# Altium project PX4FMUv2.4.6.PrjPcb (part 2 of 2)

## Sheet PX4FMUv2.4.6_9.SchDoc
size 282 x 200 mm
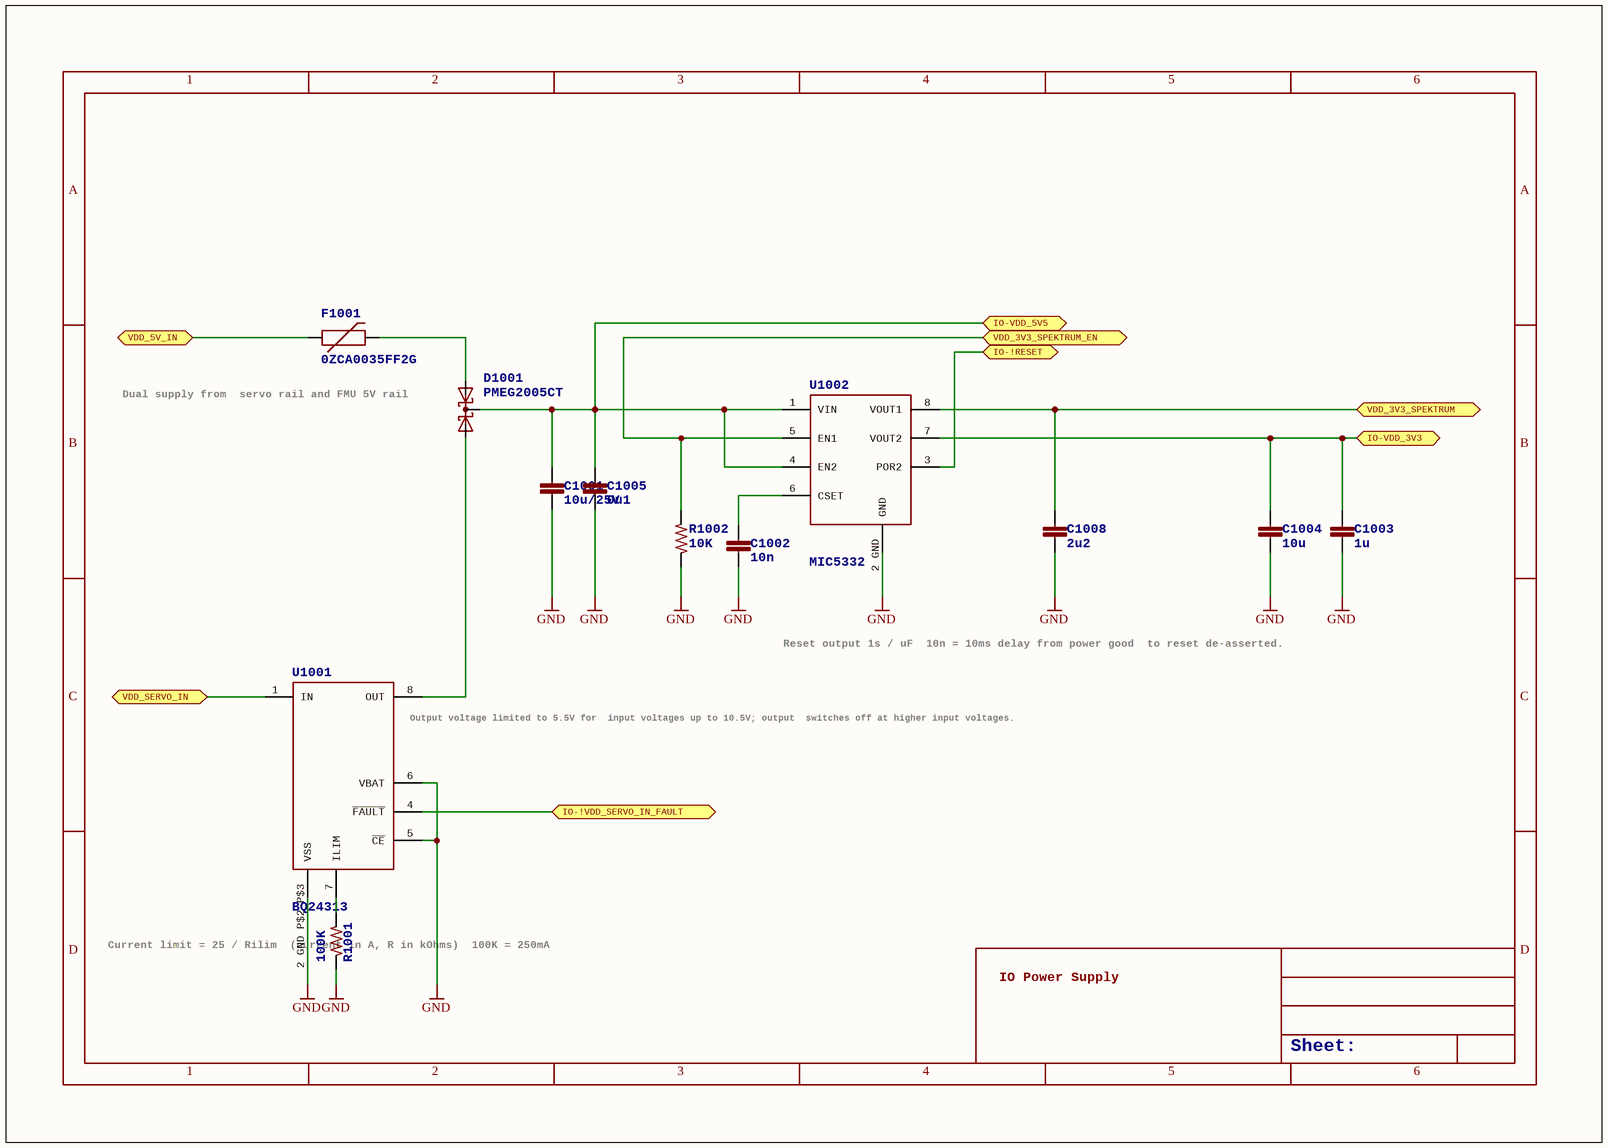
[diagram p9: PX4FMUv2.4.6_9.SchDoc]

### Parts
C1001  10u/25V  [0805-CAP]
C1002  10n  [0402-CAP]
C1003  1u  [0603-CAP]
C1004  10u  [0603-CAP]
C1005  0u1  [0402-CAP]
C1008  2u2  [0402-CAP]
D1001  PMEG2005CT  [SOT23-3]
F1001  0ZCA0035FF2G  [PTC-1206]
R1001  100K  [0402-RES]
R1002  10K  [0402-RES]
U1001  BQ24313  [QFN8-DSG]
U1002  MIC5332  [MLF-8-EPAD]

### Ports
IO-!RESET, IO-!VDD_SERVO_IN_FAULT, IO-VDD_3V3, IO-VDD_5V5, VDD_3V3_SPEKTRUM, VDD_3V3_SPEKTRUM_EN, VDD_5V_IN, VDD_SERVO_IN

### Nets
GND: C1001.P$2 C1002.P$2 C1003.P$2 C1004.P$2 C1005.P$2 C1008.P$2 R1001.P$1 R1002.P$1 U1001.2_GND_P$2_P$3(VSS) U1001.5(~{CE}) U1001.6(VBAT) U1002.2_GND(GND)
NetC702_P$1: F1001.1 ; port VDD_5V_IN
NetC801_P$2: U1002.3(POR2) ; port IO-!RESET
NetC802_P$1: C1003.P$1 C1004.P$1 U1002.7(VOUT2) ; port IO-VDD_3V3
NetC1001_P$1: C1001.P$1 C1005.P$1 D1001.3(CC) U1002.1(VIN) U1002.4(EN2) ; port IO-VDD_5V5
NetC1002_P$1: C1002.P$1 U1002.6(CSET)
NetC1008_P$1: C1008.P$1 U1002.8(VOUT1) ; port VDD_3V3_SPEKTRUM
NetD1001_1: D1001.1(A1) F1001.2
NetD1001_2: D1001.2(A2) U1001.8(OUT)
NetL901_P$2: U1001.1(IN) ; port VDD_SERVO_IN
NetR1001_P$2: R1001.P$2 U1001.7(ILIM)
NetR1002_P$2: R1002.P$2 U1002.5(EN1) ; port VDD_3V3_SPEKTRUM_EN
NetU801_38: U1001.4(~{FAULT}) ; port IO-!VDD_SERVO_IN_FAULT

### Notes on the sheet
- (near F1001) Dual supply from
  servo rail and FMU 5V rail
- Reset output 1s / uF
  10n = 10ms delay from power good
  to reset de-asserted.
- (near U1001) Output voltage limited to 5.5V for
  input voltages up to 10.5V; output
  switches off at higher input voltages.
- (near R1001) Current limit = 25 / Rilim
  (current in A, R in kOhms)
  100K = 250mA
- IO Power Supply
- Sheet:
- 1
- 2
- 3
- 4
- 5
- 6
- A
- B
- C
- D

### Library data of the parts
C1001 = CAP0805: CapacitorStandard 0603 ceramic capacitor, and 0.1" leaded capacitor.; PARTNO: CL21A106KAYNNNE
C1002 = CAP0402: CapacitorStandard 0603 ceramic capacitor, and 0.1" leaded capacitor.; PARTNO: CC0402KRX7R7BB103
C1003 = CAP0603: CapacitorStandard 0603 ceramic capacitor, and 0.1" leaded capacitor.; PARTNO: CC0603ZRY5V7BB105
C1004 = CAP0603: CapacitorStandard 0603 ceramic capacitor, and 0.1" leaded capacitor.; PARTNO: C1608X5R1A106K080AC
C1005 = CAP0402: CapacitorStandard 0603 ceramic capacitor, and 0.1" leaded capacitor.; PARTNO: CC0402ZRY5V7BB104
C1008 = CAP0402: CapacitorStandard 0603 ceramic capacitor, and 0.1" leaded capacitor.; PARTNO: C1005X6S1C225K050BC
D1001 = PMEG2005CT: 500 mA low VF dual MEGA Schottky barrier rectifier   http://www.nxp.com/documents/data_sheet/PMEG2005CT.pdf; PARTNO: PMEG2005CT
F1001 = PTCSMD: Resettable Fuse PTCResettable Fuse. Spark Fun Electronics SKU : COM-08357; PARTNO: 0ZCA0035FF2G
R1001 = RESISTOR0402-RES: as R713 on sheet PX4FMUv2.4.6_6
R1002 = RESISTOR0402-RES: ResistorBasic schematic elements and footprints for 0603, 1206, and PTH 1/10th watt (small) resistors.; PARTNO: RC0402FR-0710KL
U1001 = BQ24313: PARTNO: BQ24313DSGT
U1002 = MIC5332: PARTNO: MIC5332-SSYMT

## Sheet PX4FMUv2.4.6_10.SchDoc
size 282 x 200 mm
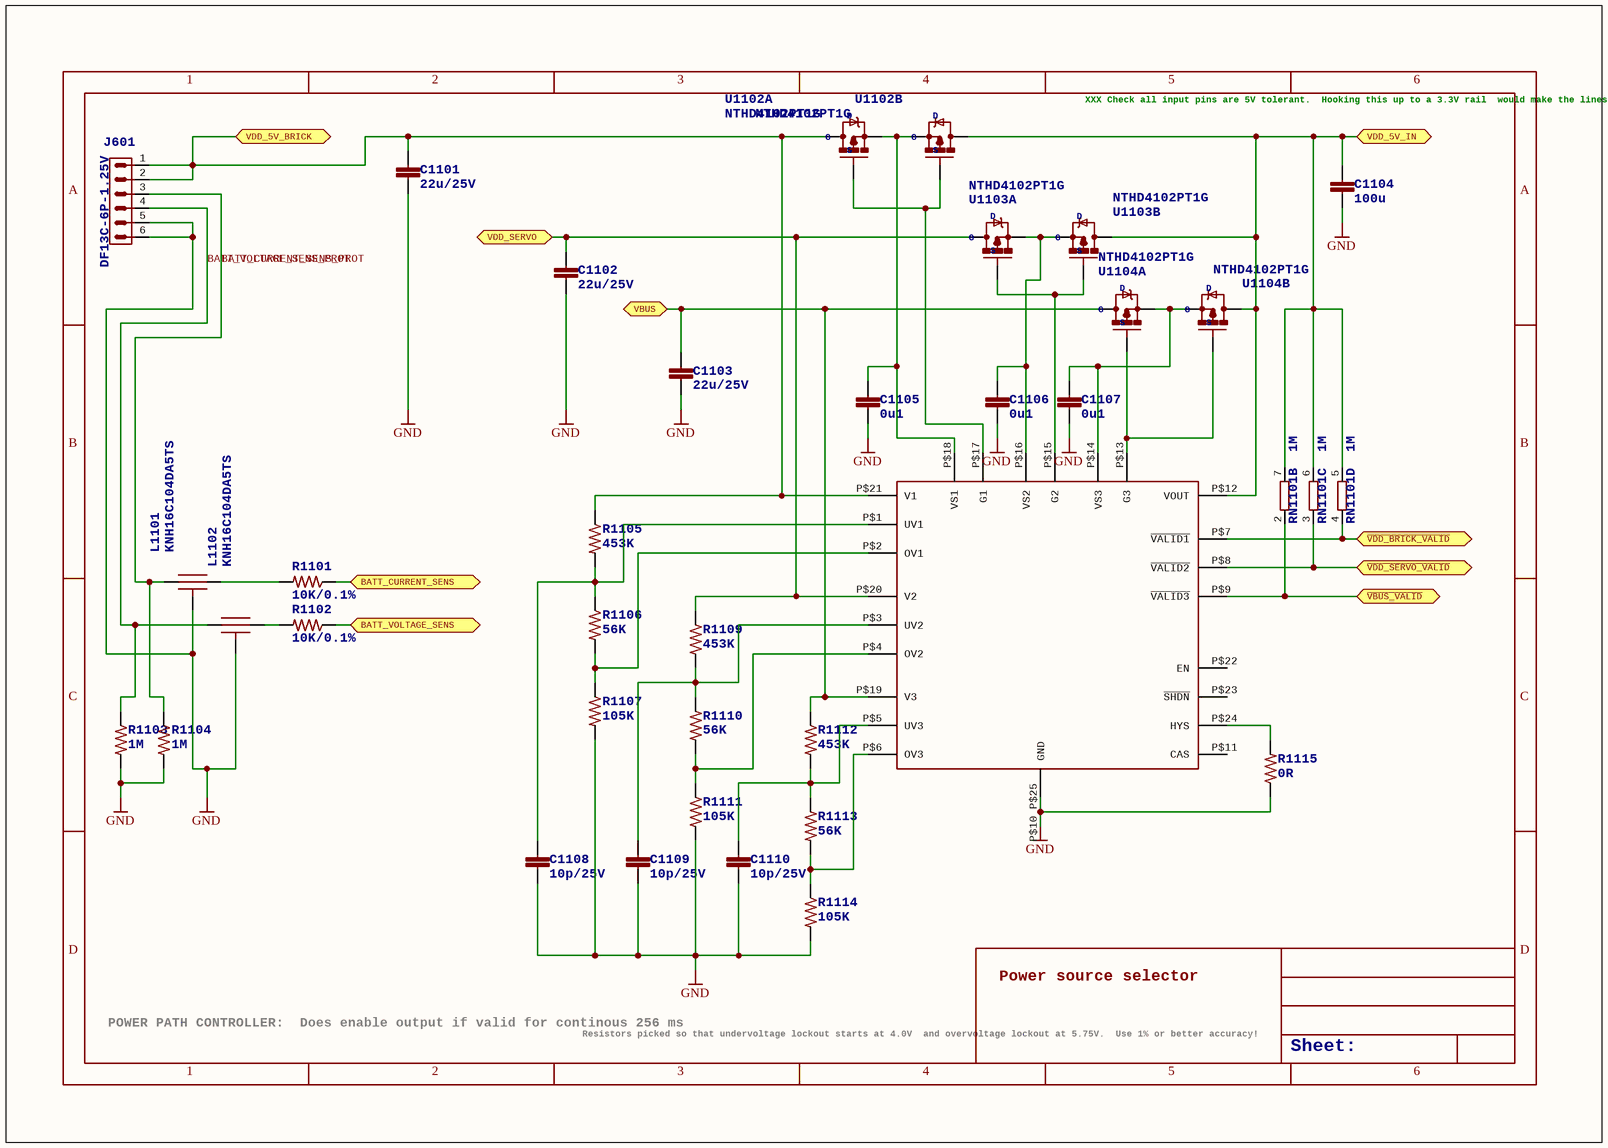
[diagram p10: PX4FMUv2.4.6_10.SchDoc]

### Parts
C1101  22u/25V  [0805-CAP]
C1102  22u/25V  [0805-CAP]
C1103  22u/25V  [0805-CAP]
C1104  100u  [1206-CAP]
C1105  0u1  [0402-CAP]
C1106  0u1  [0402-CAP]
C1107  0u1  [0402-CAP]
C1108  10p/25V  [0402-CAP]
C1109  10p/25V  [0402-CAP]
C1110  10p/25V  [0402-CAP]
J601  DF13C-6P-1.25V  [DF13C-6P-1.25V]
L1101  KNH16C104DA5TS  [KYOCERA-KNH16-DA]
L1102  KNH16C104DA5TS  [KYOCERA-KNH16-DA]
R1101  10K/0.1%  [0402-RES]
R1102  10K/0.1%  [0402-RES]
R1103  1M  [0402-RES]
R1104  1M  [0402-RES]
R1105  453K  [0402-RES]
R1106  56K  [0402-RES]
R1107  105K  [0402-RES]
R1109  453K  [0402-RES]
R1110  56K  [0402-RES]
R1111  105K  [0402-RES]
R1112  453K  [0402-RES]
R1113  56K  [0402-RES]
R1114  105K  [0402-RES]
R1115  0R  [0402-RES]
RN1101  1M  [EXB28V]  (parts B,C,D of 4)
U1101  LTC4417  [MO-220]  (value not drawn)
U1102  NTHD4102PT1G  [1206-8]  (parts A,B of 2)
U1103  NTHD4102PT1G  [1206-8]  (parts A,B of 2)
U1104  NTHD4102PT1G  [1206-8]  (parts A,B of 2)

### Ports
BATT_CURRENT_SENS, BATT_VOLTAGE_SENS, VBUS, VDD_5V_BRICK, VDD_5V_IN, VDD_SERVO, ~{VBUS_VALID}, ~{VDD_BRICK_VALID}, ~{VDD_SERVO_VALID}

### Nets
GND: C1101.P$2 C1102.P$2 C1103.P$2 C1104.P$2 C1105.P$2 C1106.P$2 C1107.P$2 C1108.P$2 C1109.P$2 C1110.P$2 J601.5 J601.6 L1101.P$3_P$4_P$5(P$3) L1102.P$3_P$4_P$5(P$3) R1103.P$2 R1104.P$2 R1107.P$2 R1111.P$2 R1114.P$2 R1115.P$1 U1101.P$10_P$25(GND)
BATT_CURRENT_SENS_PROT: J601.3 L1101.P$1 R1104.P$1
BATT_VOLTAGE_SENS_PROT: J601.4 L1102.P$1 R1103.P$1
Net!VBUS_VALID_P$1: RN1101.2 U1101.P$9(~{VALID3}) ; port ~{VBUS_VALID}
Net!VDD_BRICK_VALID_P$1: RN1101.4 U1101.P$7(~{VALID1}) ; port ~{VDD_BRICK_VALID}
Net!VDD_SERVO_VALID_P$1: RN1101.3 U1101.P$8(~{VALID2}) ; port ~{VDD_SERVO_VALID}
NetC702_P$1: C1104.P$1 RN1101.5 RN1101.6 RN1101.7 U1101.P$12(VOUT) U1102.P$5_P$6(D) U1103.P$5_P$6(D) U1104.P$5_P$6(D) ; port VDD_5V_IN
NetC1101_P$1: C1101.P$1 J601.1 J601.2 R1105.P$1 U1101.P$21(V1) U1102.P$7_P$8(D) ; port VDD_5V_BRICK
NetC1102_P$1: C1102.P$1 R1109.P$1 U1101.P$20(V2) U1103.P$7_P$8(D) ; port VDD_SERVO
NetC1103_P$1: C1103.P$1 R1112.P$1 U1101.P$19(V3) U1104.P$7_P$8(D) ; port VBUS
NetC1105_P$1: C1105.P$1 U1101.P$18(VS1) U1102.P$1(S) U1102.P$3(S)
NetC1106_P$1: C1106.P$1 U1101.P$16(VS2) U1103.P$1(S) U1103.P$3(S)
NetC1107_P$1: C1107.P$1 U1101.P$14(VS3) U1104.P$1(S) U1104.P$3(S)
NetC1108_P$1: C1108.P$1 R1105.P$2 R1106.P$1 U1101.P$1(UV1)
NetC1109_P$1: C1109.P$1 R1109.P$2 R1110.P$1 U1101.P$3(UV2)
NetC1110_P$1: C1110.P$1 R1112.P$2 R1113.P$1 U1101.P$5(UV3)
NetL1101_P$2: L1101.P$2 R1101.P$2
NetL1102_P$2: L1102.P$2 R1102.P$2
NetR1101_P$1: R1101.P$1 ; port BATT_CURRENT_SENS
NetR1102_P$1: R1102.P$1 ; port BATT_VOLTAGE_SENS
NetR1106_P$2: R1106.P$2 R1107.P$1 U1101.P$2(OV1)
NetR1110_P$2: R1110.P$2 R1111.P$1 U1101.P$4(OV2)
NetR1113_P$2: R1113.P$2 R1114.P$1 U1101.P$6(OV3)
NetR1115_P$2: R1115.P$2 U1101.P$24(HYS)
NetU1101_P$13: U1101.P$13(G3) U1104.P$2(G) U1104.P$4(G)
NetU1101_P$15: U1101.P$15(G2) U1103.P$2(G) U1103.P$4(G)
NetU1101_P$17: U1101.P$17(G1) U1102.P$2(G) U1102.P$4(G)

Not connected (* = marked no-connect by the designer): U1101 P$11(CAS) P$22(EN) P$23(~{SHDN})

### Notes on the sheet
- XXX Check all input pins are 5V tolerant.
  Hooking this up to a 3.3V rail
  would make the lines non-readable during power-up sequencing
- POWER PATH CONTROLLER:
  Does enable output if valid for continous 256 ms
- Power source selector
- Resistors picked so that undervoltage lockout starts at 4.0V
  and overvoltage lockout at 5.75V.
  Use 1% or better accuracy!
- Sheet:
- 1
- 2
- 3
- 4
- 5
- 6
- A
- B
- C
- D

### Library data of the parts
C1101-C1103 = CAP0805: CapacitorStandard 0603 ceramic capacitor, and 0.1" leaded capacitor.; PARTNO: CL21A226MAQNNNE
C1104 = CAP1206: CapacitorStandard 0603 ceramic capacitor, and 0.1" leaded capacitor.; PARTNO: C3216X5R1A107M160AC
C1105-C1107 = CAP0402: CapacitorStandard 0603 ceramic capacitor, and 0.1" leaded capacitor.; PARTNO: C1005X7R1E104K050BB
C1108-C1110 = CAP0402: CapacitorStandard 0603 ceramic capacitor, and 0.1" leaded capacitor.; PARTNO: C0402C100J3GACTU
J601 = DF13-6P-1.25V: DF13-6P 1.25mm Pitch Miniature Crimping Connector.
L1101 L1102 = KNH16C104DA5TS: Kyocera KNH16C104DA5TS EMI filter
R1101 R1102 = RESISTOR0402-RES: ResistorBasic schematic elements and footprints for 0603, 1206, and PTH 1/10th watt (small) resistors.; PARTNO: ERA-2AEB103X
R1103 R1104 = RESISTOR0402-RES: ResistorBasic schematic elements and footprints for 0603, 1206, and PTH 1/10th watt (small) resistors.; PARTNO: RC0402FR-071ML
R1105 R1109 R1112 = RESISTOR0402-RES: ResistorBasic schematic elements and footprints for 0603, 1206, and PTH 1/10th watt (small) resistors.; PARTNO: RMCF0402FT453K
R1106 R1110 R1113 = RESISTOR0402-RES: ResistorBasic schematic elements and footprints for 0603, 1206, and PTH 1/10th watt (small) resistors.; PARTNO: ERA-2AEB563X
R1107 R1111 R1114 = RESISTOR0402-RES: ResistorBasic schematic elements and footprints for 0603, 1206, and PTH 1/10th watt (small) resistors.; PARTNO: ERJ-2RKF1053X
R1115 = RESISTOR0402-RES: ResistorBasic schematic elements and footprints for 0603, 1206, and PTH 1/10th watt (small) resistors.; PARTNO: ERJ-2GE0R00X
RN1101 = 4R-NEXB28V: Array Chip Resistor   Source: RS Component / Phycomp; PARTNO: EXB-28V105JX; OC_FARNELL: unknown; OC_NEWARK: unknown
U1101 = LTC4117: PARTNO: LTC4417IUF#PBF
U1102-U1104 = MOSFET-DUAL-PCHANNEL-CHIPFET: PARTNO: NTHD4102PT1G; D: D; S: S; G: G

## Sheet PX4FMUv2.4.6_11.SchDoc
size 282 x 200 mm
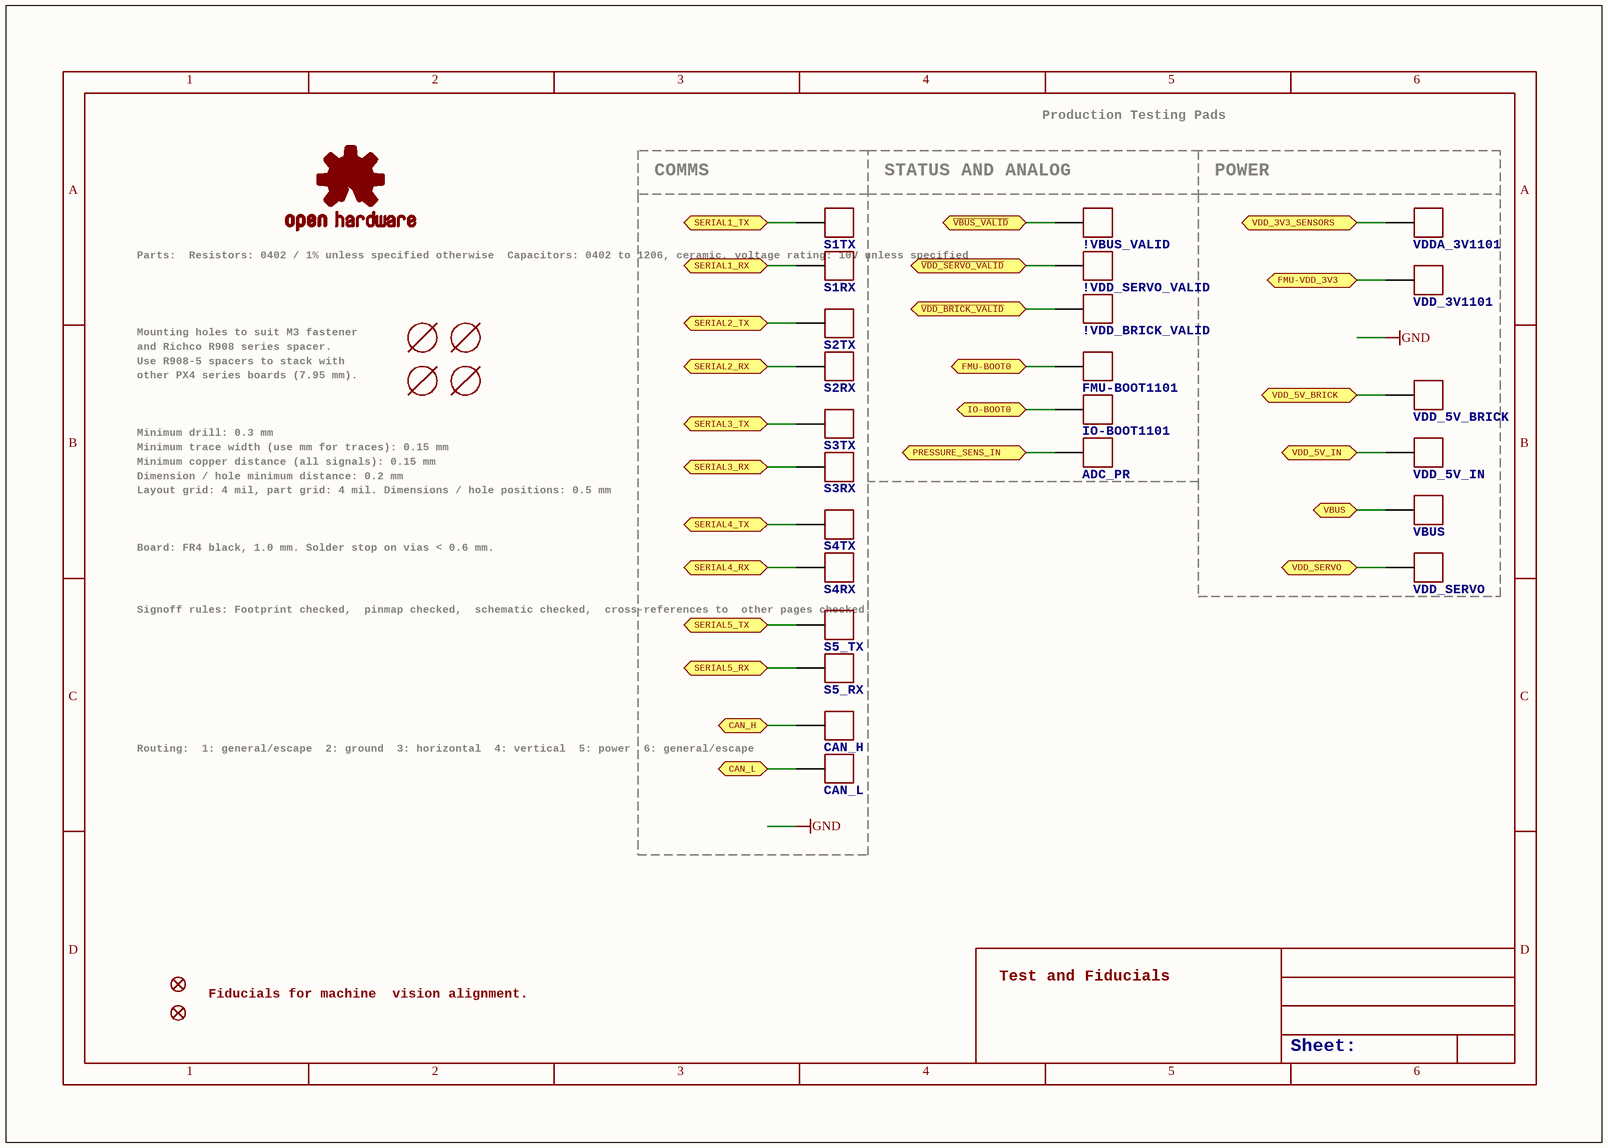
[diagram p11: PX4FMUv2.4.6_11.SchDoc]

### Parts
!VBUS_VALID  PAD.04  [PAD.04X.04]  (value not drawn)
!VDD_BRICK_VALID  PAD.04  [PAD.04X.04]  (value not drawn)
!VDD_SERVO_VALID  PAD.04  [PAD.04X.04]  (value not drawn)
ADC_PR  PAD.04  [PAD.04X.04]  (value not drawn)
CAN_H  PAD.04  [PAD.04X.04]  (value not drawn)
CAN_L  PAD.04  [PAD.04X.04]  (value not drawn)
FMU-BOOT1101  PAD.04  [PAD.04X.04]  (value not drawn)
IO-BOOT1101  PAD.04  [PAD.04X.04]  (value not drawn)
JP1  FIDUCIAL1.5X3  [FIDUCIAL-1.5X3]  (value not drawn)
JP2  FIDUCIAL1.5X3  [FIDUCIAL-1.5X3]  (value not drawn)
M3_MOUNT1101  MOUNT-HOLE3.1MM  [MOUNT-HOLE3.1]  (value not drawn)
M3_MOUNT1102  MOUNT-HOLE3.1MM  [MOUNT-HOLE3.1]  (value not drawn)
M3_MOUNT1103  MOUNT-HOLE3.1MM  [MOUNT-HOLE3.1]  (value not drawn)
M3_MOUNT1104  MOUNT-HOLE3.1MM  [MOUNT-HOLE3.1]  (value not drawn)
OSHW_LOGO  OSHW-LOGOS  [OSHW-LOGO-S]  (value not drawn)
S1RX  PAD.04  [PAD.04X.04]  (value not drawn)
S1TX  PAD.04  [PAD.04X.04]  (value not drawn)
S2RX  PAD.04  [PAD.04X.04]  (value not drawn)
S2TX  PAD.04  [PAD.04X.04]  (value not drawn)
S3RX  PAD.04  [PAD.04X.04]  (value not drawn)
S3TX  PAD.04  [PAD.04X.04]  (value not drawn)
S4RX  PAD.04  [PAD.04X.04]  (value not drawn)
S4TX  PAD.04  [PAD.04X.04]  (value not drawn)
S5_RX  PAD.04  [PAD.04X.04]  (value not drawn)
S5_TX  PAD.04  [PAD.04X.04]  (value not drawn)
VBUS  PAD.04  [PAD.04X.04]  (value not drawn)
VDD_3V1101  PAD.04  [PAD.04X.04]  (value not drawn)
VDD_5V_BRICK  PAD.04  [PAD.04X.04]  (value not drawn)
VDD_5V_IN  PAD.04  [PAD.04X.04]  (value not drawn)
VDD_SERVO  PAD.04  [PAD.04X.04]  (value not drawn)
VDDA_3V1101  PAD.04  [PAD.04X.04]  (value not drawn)

### Ports
CAN_H, CAN_L, FMU-BOOT0, FMU-VDD_3V3, IO-BOOT0, PRESSURE_SENS_IN, SERIAL1_RX, SERIAL1_TX, SERIAL2_RX, SERIAL2_TX, SERIAL3_RX, SERIAL3_TX, SERIAL4_RX, SERIAL4_TX, SERIAL5_RX, SERIAL5_TX, VBUS, VDD_3V3_SENSORS, VDD_5V_BRICK, VDD_5V_IN, VDD_SERVO, ~{VBUS_VALID}, ~{VDD_BRICK_VALID}, ~{VDD_SERVO_VALID}

### Nets
Net!VBUS_VALID_P$1: !VBUS_VALID.P$1 ; port ~{VBUS_VALID}
Net!VDD_BRICK_VALID_P$1: !VDD_BRICK_VALID.P$1 ; port ~{VDD_BRICK_VALID}
Net!VDD_SERVO_VALID_P$1: !VDD_SERVO_VALID.P$1 ; port ~{VDD_SERVO_VALID}
NetADC_PR_P$1: ADC_PR.P$1 ; port PRESSURE_SENS_IN
NetC101_P$1: VDD_3V1101.P$1 ; port FMU-VDD_3V3
NetC501_P$1: VDDA_3V1101.P$1 ; port VDD_3V3_SENSORS
NetC702_P$1: VDD_5V_IN.P$1 ; port VDD_5V_IN
NetC1101_P$1: VDD_5V_BRICK.P$1 ; port VDD_5V_BRICK
NetC1102_P$1: VDD_SERVO.P$1 ; port VDD_SERVO
NetC1103_P$1: VBUS.P$1 ; port VBUS
NetCAN_H_P$1: CAN_H.P$1 ; port CAN_H
NetCAN_L_P$1: CAN_L.P$1 ; port CAN_L
NetFMU-BOOT1101_P$1: FMU-BOOT1101.P$1 ; port FMU-BOOT0
NetIO-BOOT1101_P$1: IO-BOOT1101.P$1 ; port IO-BOOT0
NetJ201_2: S1TX.P$1 ; port SERIAL1_TX
NetJ201_3: S1RX.P$1 ; port SERIAL1_RX
NetJ202_2: S2TX.P$1 ; port SERIAL2_TX
NetJ202_3: S2RX.P$1 ; port SERIAL2_RX
NetJ203_2: S3TX.P$1 ; port SERIAL3_TX
NetJ203_3: S3RX.P$1 ; port SERIAL3_RX
NetJ204_2: S4TX.P$1 ; port SERIAL4_TX
NetJ204_3: S4RX.P$1 ; port SERIAL4_RX
NetJ204_4: S5_TX.P$1 ; port SERIAL5_TX
NetJ204_5: S5_RX.P$1 ; port SERIAL5_RX

### Notes on the sheet
- Production Testing Pads
- COMMS
- STATUS AND ANALOG
- POWER
- (near S1RX) Parts:
  Resistors: 0402 / 1% unless specified otherwise
  Capacitors: 0402 to 1206, ceramic, voltage rating: 10V unless specified
- Mounting holes to suit M3 fastener
- and Richco R908 series spacer.
- Use R908-5 spacers to stack with
- other PX4 series boards (7.95 mm).
- Minimum drill: 0.3 mm
- Minimum trace width (use mm for traces): 0.15 mm
- Minimum copper distance (all signals): 0.15 mm
- Dimension / hole minimum distance: 0.2 mm
- Layout grid: 4 mil, part grid: 4 mil. Dimensions / hole positions: 0.5 mm
- Board: FR4 black, 1.0 mm. Solder stop on vias < 0.6 mm.
- Signoff rules: Footprint checked,
  pinmap checked,
  schematic checked,
  cross-references to
  other pages checked.
- Routing:
  1: general/escape
  2: ground
  3: horizontal
  4: vertical
  5: power
  6: general/escape
- Fiducials for machine
  vision alignment.
- Test and Fiducials
- Sheet:
- 1
- 2
- 3
- 4
- 5
- 6
- A
- B
- C
- D

### Library data of the parts
!VBUS_VALID !VDD_BRICK_VALID !VDD_SERVO_VALID ADC_PR CAN_H CAN_L FMU-BOOT1101 IO-BOOT1101 S1RX S1TX S2RX S2TX S3RX S3TX S4RX S4TX S5_RX S5_TX VBUS VDD_3V1101 VDD_5V_BRICK VDD_5V_IN VDD_SERVO VDDA_3V1101 = PAD.04: Test pad This footprint includes three classes: The actual test pads, a pogo-pin footprint to mount the pogo-pin as through-hole part and a hole footprint which allows the head of the pogo-pin to pass through (do NOT use the hole to mount the pogo-pin). In a typical test setup, the stack would consist of three PCBs: The actual PCB under testing with a test pad on the bottom, then a second PCB with the hole for the pogo-pin head where the PCB under testing is pressed on and a third PCB at 30 mm / 1.2" distance with the pogo-pin footprints. The pogo-pins are soldered to the last PCB. To create the stack, copy the board under testing and exchange the footprints - this way the correct positioning is ensured.; BOM: EXCLUDE; PARTNO: *
JP1 JP2 = FIDUCIAL1.5X3: Fiducial Alignment PointsVarious fiducial points for machine vision alignment.; BOM: EXCLUDE; PARTNO: *
M3_MOUNT1101-M3_MOUNT1104 = MOUNT-HOLE3.1MM: BOM: EXCLUDE; PARTNO: *
OSHW_LOGO = OSHW-LOGOS: Open Source Hardware Logo This logo indicates the piece of hardware it is found on incorporates a OSHW license and/or adheres to the definition of open source hardware found here: http://freedomdefined.org/OSHW; BOM: EXCLUDE; PARTNO: *

## Nets that join several sheets
GND: PX4FMUv2.4.6_0 (7 pins), PX4FMUv2.4.6_1 (14 pins), PX4FMUv2.4.6_2 (11 pins), PX4FMUv2.4.6_3 (20 pins), PX4FMUv2.4.6_4 (31 pins), PX4FMUv2.4.6_5 (34 pins), PX4FMUv2.4.6_6 (14 pins), PX4FMUv2.4.6_7 (21 pins), PX4FMUv2.4.6_8 (13 pins), PX4FMUv2.4.6_9 (12 pins), PX4FMUv2.4.6_10 (21 pins)
Net!VBUS_VALID_P$1: PX4FMUv2.4.6_0 (U101.15), PX4FMUv2.4.6_10 (RN1101.2 U1101.P$9), PX4FMUv2.4.6_11 (!VBUS_VALID.P$1)
Net!VDD_BRICK_VALID_P$1: PX4FMUv2.4.6_0 (U101.91), PX4FMUv2.4.6_10 (RN1101.4 U1101.P$7), PX4FMUv2.4.6_11 (!VDD_BRICK_VALID.P$1)
Net!VDD_SERVO_VALID_P$1: PX4FMUv2.4.6_0 (U101.93), PX4FMUv2.4.6_10 (RN1101.3 U1101.P$8), PX4FMUv2.4.6_11 (!VDD_SERVO_VALID.P$1)
NetADC_PR_P$1: PX4FMUv2.4.6_3 (J402.2 R406.P$2), PX4FMUv2.4.6_11 (ADC_PR.P$1)
NetB601_1: PX4FMUv2.4.6_5 (B601.1 R608.P$1 U101.6), PX4FMUv2.4.6_7 (U801.1)
NetC101_P$1: PX4FMUv2.4.6_0 (C101.P$1 U102.3 U102.7 U102.8), PX4FMUv2.4.6_1 (8 pins), PX4FMUv2.4.6_2 (9 pins), PX4FMUv2.4.6_3 (C402.P$1 R401.P$2 R402.P$2 U401.3), PX4FMUv2.4.6_5 (15 pins), PX4FMUv2.4.6_6 (C701.P$1 U701.1 U701.10), PX4FMUv2.4.6_8 (C902.P$1 U901.2 U901.10 U901.19), PX4FMUv2.4.6_11 (VDD_3V1101.P$1)
NetC401_P$1: PX4FMUv2.4.6_0 (U101.34), PX4FMUv2.4.6_3 (C401.P$1 R403.P$2 R406.P$1)
NetC501_P$1: PX4FMUv2.4.6_4 (19 pins), PX4FMUv2.4.6_5 (C605.P$1 C617.P$1 R621.2 U603.8), PX4FMUv2.4.6_11 (VDDA_3V1101.P$1)
NetC609_P$2: PX4FMUv2.4.6_5 (5 pins), PX4FMUv2.4.6_6 (U701.4)
NetC614_P$1: PX4FMUv2.4.6_1 (L201.P$1), PX4FMUv2.4.6_5 (C614.P$1 U601.8)
NetC618_P$1: PX4FMUv2.4.6_1 (L202.P$1 L203.P$1), PX4FMUv2.4.6_3 (L401.P$1 L402.P$1 L403.P$1 L404.P$1), PX4FMUv2.4.6_5 (C618.P$1 U602.8)
NetC702_P$1: PX4FMUv2.4.6_5 (L603.P$1 R609.P$2 U601.1 U602.1), PX4FMUv2.4.6_6 (8 pins), PX4FMUv2.4.6_9 (F1001.1), PX4FMUv2.4.6_10 (8 pins), PX4FMUv2.4.6_11 (VDD_5V_IN.P$1)
NetC801_P$2: PX4FMUv2.4.6_7 (C801.P$2 S801.A1 U801.7), PX4FMUv2.4.6_9 (U1002.3)
NetC802_P$1: PX4FMUv2.4.6_6 (D701.C J702.1), PX4FMUv2.4.6_7 (8 pins), PX4FMUv2.4.6_8 (6 pins), PX4FMUv2.4.6_9 (C1003.P$1 C1004.P$1 U1002.7)
NetC1001_P$1: PX4FMUv2.4.6_6 (LED702.A LED703.A LED705.A), PX4FMUv2.4.6_8 (J901.2), PX4FMUv2.4.6_9 (5 pins)
NetC1008_P$1: PX4FMUv2.4.6_7 (D801.C J801.P$1), PX4FMUv2.4.6_9 (C1008.P$1 U1002.8)
NetC1101_P$1: PX4FMUv2.4.6_10 (6 pins), PX4FMUv2.4.6_11 (VDD_5V_BRICK.P$1)
NetC1102_P$1: PX4FMUv2.4.6_8 (D904.ANODE J901.5 8 11 14 17 20 23 26 29 32 35 38 41 44 47 R922.P$2), PX4FMUv2.4.6_10 (C1102.P$1 R1109.P$1 U1101.P$20 U1103.P$7 P$8), PX4FMUv2.4.6_11 (VDD_SERVO.P$1)
NetC1103_P$1: PX4FMUv2.4.6_0 (U101.68), PX4FMUv2.4.6_2 (J301.VBUS J302.1 U302.5), PX4FMUv2.4.6_10 (C1103.P$1 R1112.P$1 U1101.P$19 U1104.P$7 P$8), PX4FMUv2.4.6_11 (VBUS.P$1)
NetCAN_H_P$1: PX4FMUv2.4.6_3 (J405.2 R409.P$1 U401.7), PX4FMUv2.4.6_11 (CAN_H.P$1)
NetCAN_L_P$1: PX4FMUv2.4.6_3 (J405.3 R409.P$2 U401.6), PX4FMUv2.4.6_11 (CAN_L.P$1)
NetD901_C: PX4FMUv2.4.6_7 (U801.29), PX4FMUv2.4.6_8 (D901.C R909.P$1 U903.2)
NetFMU-BOOT1101_P$1: PX4FMUv2.4.6_5 (R611.P$2 U101.94), PX4FMUv2.4.6_11 (FMU-BOOT1101.P$1)
NetIO-BOOT1101_P$1: PX4FMUv2.4.6_7 (R801.P$1 U801.44), PX4FMUv2.4.6_11 (IO-BOOT1101.P$1)
NetJ201_2: PX4FMUv2.4.6_1 (J201.2 R210.P$2), PX4FMUv2.4.6_11 (S1TX.P$1)
NetJ201_3: PX4FMUv2.4.6_1 (J201.3 R203.P$2), PX4FMUv2.4.6_11 (S1RX.P$1)
NetJ202_2: PX4FMUv2.4.6_1 (J202.2 R209.P$2), PX4FMUv2.4.6_11 (S2TX.P$1)
NetJ202_3: PX4FMUv2.4.6_1 (J202.3 R202.P$2), PX4FMUv2.4.6_11 (S2RX.P$1)
NetJ203_2: PX4FMUv2.4.6_1 (J203.2 R214.P$2), PX4FMUv2.4.6_11 (S3TX.P$1)
NetJ203_3: PX4FMUv2.4.6_1 (J203.3 R207.P$2), PX4FMUv2.4.6_11 (S3RX.P$1)
NetJ204_2: PX4FMUv2.4.6_1 (J204.2 R213.P$2), PX4FMUv2.4.6_11 (S4TX.P$1)
NetJ204_3: PX4FMUv2.4.6_1 (J204.3 R206.P$2), PX4FMUv2.4.6_11 (S4RX.P$1)
NetJ204_4: PX4FMUv2.4.6_1 (J204.4 R212.P$2), PX4FMUv2.4.6_11 (S5_TX.P$1)
NetJ204_5: PX4FMUv2.4.6_1 (J204.5 R205.P$2), PX4FMUv2.4.6_11 (S5_RX.P$1)
NetJ403_2: PX4FMUv2.4.6_0 (U101.1), PX4FMUv2.4.6_3 (J403.2)
NetJ403_3: PX4FMUv2.4.6_0 (U101.4), PX4FMUv2.4.6_3 (J403.3)
NetJ403_4: PX4FMUv2.4.6_0 (U101.5), PX4FMUv2.4.6_3 (J403.4)
NetJ403_5: PX4FMUv2.4.6_0 (U101.3), PX4FMUv2.4.6_3 (J403.5)
NetJ403_6: PX4FMUv2.4.6_0 (U101.8), PX4FMUv2.4.6_3 (J403.6)
NetJ702_3: PX4FMUv2.4.6_6 (J702.3 R713.P$1), PX4FMUv2.4.6_7 (U801.41)
NetJX301_2: PX4FMUv2.4.6_0 (U101.72), PX4FMUv2.4.6_2 (JX301.2)
NetJX301_4: PX4FMUv2.4.6_0 (U101.76), PX4FMUv2.4.6_2 (JX301.4)
NetJX301_6: PX4FMUv2.4.6_0 (U101.89), PX4FMUv2.4.6_2 (JX301.6)
NetJX801_1: PX4FMUv2.4.6_0 (R101.P$2), PX4FMUv2.4.6_7 (JX801.1 U801.30)
NetL901_P$2: PX4FMUv2.4.6_8 (L901.P$2), PX4FMUv2.4.6_9 (U1001.1)
NetR215_P$1: PX4FMUv2.4.6_0 (U101.92), PX4FMUv2.4.6_1 (R215.P$1)
NetR216_P$1: PX4FMUv2.4.6_0 (U101.51), PX4FMUv2.4.6_1 (R216.P$1)
NetR301_P$1: PX4FMUv2.4.6_0 (U101.78), PX4FMUv2.4.6_2 (R301.P$1 U301.1)
NetR302_P$1: PX4FMUv2.4.6_0 (U101.79), PX4FMUv2.4.6_2 (R302.P$1 U301.2)
NetR303_P$1: PX4FMUv2.4.6_0 (U101.83), PX4FMUv2.4.6_2 (R303.P$1 U301.3)
NetR304_P$1: PX4FMUv2.4.6_0 (U101.65), PX4FMUv2.4.6_2 (R304.P$1 U301.7)
NetR305_P$1: PX4FMUv2.4.6_0 (U101.66), PX4FMUv2.4.6_2 (R305.P$1 U301.8)
NetR306_P$1: PX4FMUv2.4.6_0 (U101.47), PX4FMUv2.4.6_2 (R306.P$1), PX4FMUv2.4.6_6 (U701.3)
NetR307_P$1: PX4FMUv2.4.6_0 (U101.48), PX4FMUv2.4.6_2 (R307.P$1), PX4FMUv2.4.6_6 (U701.2)
NetR401_P$1: PX4FMUv2.4.6_0 (U101.95), PX4FMUv2.4.6_3 (R401.P$1 R404.P$1)
NetR402_P$1: PX4FMUv2.4.6_0 (U101.96), PX4FMUv2.4.6_3 (R402.P$1 R405.P$1)
NetR407_P$1: PX4FMUv2.4.6_0 (U101.33), PX4FMUv2.4.6_3 (R407.P$1)
NetR408_P$1: PX4FMUv2.4.6_0 (U101.18), PX4FMUv2.4.6_3 (R408.P$1)
NetR602_P$1: PX4FMUv2.4.6_0 (U101.41), PX4FMUv2.4.6_5 (R602.P$1 U601.4)
NetR603_P$2: PX4FMUv2.4.6_0 (U101.2), PX4FMUv2.4.6_5 (R603.P$2 R635.P$2 U603.5)
NetR604_P$1: PX4FMUv2.4.6_0 (U101.46), PX4FMUv2.4.6_5 (R604.P$1 U602.4)
NetR609_P$1: PX4FMUv2.4.6_0 (U101.29), PX4FMUv2.4.6_5 (R609.P$1 R610.P$1)
NetR615_P$1: PX4FMUv2.4.6_0 (U101.67), PX4FMUv2.4.6_5 (R615.P$1 U601.5 U602.5)
NetR701_P$2: PX4FMUv2.4.6_0 (U101.77), PX4FMUv2.4.6_6 (R701.P$2)
NetR707_P$1: PX4FMUv2.4.6_0 (U101.43), PX4FMUv2.4.6_6 (R707.P$1)
NetR709_P$1: PX4FMUv2.4.6_6 (R709.P$1), PX4FMUv2.4.6_7 (U801.28)
NetR710_P$2: PX4FMUv2.4.6_6 (R710.P$2), PX4FMUv2.4.6_7 (U801.26)
NetR712_P$1: PX4FMUv2.4.6_6 (R712.P$1), PX4FMUv2.4.6_7 (U801.27)
NetR803_P$2: PX4FMUv2.4.6_0 (U101.64), PX4FMUv2.4.6_7 (R803.P$2)
NetR804_P$2: PX4FMUv2.4.6_0 (U101.63), PX4FMUv2.4.6_7 (R804.P$2)
NetR901_P$1: PX4FMUv2.4.6_7 (U801.15 U801.33), PX4FMUv2.4.6_8 (R901.P$1)
NetR918_P$1: PX4FMUv2.4.6_7 (U801.14), PX4FMUv2.4.6_8 (R918.P$1 R919.P$2)
NetR1002_P$2: PX4FMUv2.4.6_7 (U801.2), PX4FMUv2.4.6_9 (R1002.P$2 U1002.5)
NetR1101_P$1: PX4FMUv2.4.6_0 (U101.26), PX4FMUv2.4.6_10 (R1101.P$1)
NetR1102_P$1: PX4FMUv2.4.6_0 (U101.25), PX4FMUv2.4.6_10 (R1102.P$1)
NetU101_7: PX4FMUv2.4.6_0 (U101.7), PX4FMUv2.4.6_4 (U501.5 U502.5 X503.7)
NetU101_9: PX4FMUv2.4.6_0 (U101.9), PX4FMUv2.4.6_4 (U504.8 X503.6)
NetU101_17: PX4FMUv2.4.6_0 (U101.17), PX4FMUv2.4.6_4 (U505.8)
NetU101_23: PX4FMUv2.4.6_0 (U101.23), PX4FMUv2.4.6_1 (U202.9)
NetU101_24: PX4FMUv2.4.6_0 (U101.24), PX4FMUv2.4.6_1 (U202.8)
NetU101_30: PX4FMUv2.4.6_0 (U101.30), PX4FMUv2.4.6_4 (6 pins)
NetU101_31: PX4FMUv2.4.6_0 (U101.31), PX4FMUv2.4.6_4 (6 pins)
NetU101_32: PX4FMUv2.4.6_0 (U101.32), PX4FMUv2.4.6_4 (6 pins)
NetU101_35: PX4FMUv2.4.6_0 (U101.35), PX4FMUv2.4.6_4 (U501.6 U502.6 X503.5)
NetU101_36: PX4FMUv2.4.6_0 (U101.36), PX4FMUv2.4.6_4 (U504.9 X503.4)
NetU101_38: PX4FMUv2.4.6_0 (U101.38), PX4FMUv2.4.6_1 (U202.4)
NetU101_39: PX4FMUv2.4.6_0 (U101.39), PX4FMUv2.4.6_1 (U202.5)
NetU101_40: PX4FMUv2.4.6_0 (U101.40), PX4FMUv2.4.6_8 (U901.4)
NetU101_42: PX4FMUv2.4.6_0 (U101.42), PX4FMUv2.4.6_8 (U901.5)
NetU101_44: PX4FMUv2.4.6_0 (U101.44), PX4FMUv2.4.6_8 (U901.6)
NetU101_45: PX4FMUv2.4.6_0 (U101.45), PX4FMUv2.4.6_8 (U901.7)
NetU101_55: PX4FMUv2.4.6_0 (U101.55), PX4FMUv2.4.6_1 (U201.5)
NetU101_56: PX4FMUv2.4.6_0 (U101.56), PX4FMUv2.4.6_1 (U201.4)
NetU101_58: PX4FMUv2.4.6_0 (U101.58), PX4FMUv2.4.6_1 (U201.3)
NetU101_59: PX4FMUv2.4.6_0 (U101.59), PX4FMUv2.4.6_1 (U201.1)
NetU101_60: PX4FMUv2.4.6_0 (U101.60), PX4FMUv2.4.6_8 (U901.3)
NetU101_61: PX4FMUv2.4.6_0 (U101.61), PX4FMUv2.4.6_8 (U901.1)
NetU101_62: PX4FMUv2.4.6_0 (U101.62), PX4FMUv2.4.6_4 (U505.12)
NetU101_70: PX4FMUv2.4.6_0 (U101.70), PX4FMUv2.4.6_2 (U302.6)
NetU101_71: PX4FMUv2.4.6_0 (U101.71), PX4FMUv2.4.6_2 (U302.4)
NetU101_80: PX4FMUv2.4.6_0 (U101.80), PX4FMUv2.4.6_2 (U301.5)
NetU101_81: PX4FMUv2.4.6_0 (U101.81), PX4FMUv2.4.6_3 (U401.4)
NetU101_82: PX4FMUv2.4.6_0 (U101.82), PX4FMUv2.4.6_3 (U401.1)
NetU101_84: PX4FMUv2.4.6_0 (U101.84), PX4FMUv2.4.6_1 (U201.9)
NetU101_85: PX4FMUv2.4.6_0 (U101.85), PX4FMUv2.4.6_1 (U201.8)
NetU101_86: PX4FMUv2.4.6_0 (U101.86), PX4FMUv2.4.6_1 (U201.7)
NetU101_87: PX4FMUv2.4.6_0 (U101.87), PX4FMUv2.4.6_1 (U201.6)
NetU101_88: PX4FMUv2.4.6_0 (U101.88), PX4FMUv2.4.6_4 (U506.5)
NetU101_90: PX4FMUv2.4.6_0 (U101.90), PX4FMUv2.4.6_4 (U504.11 X503.3)
NetU101_97: PX4FMUv2.4.6_0 (U101.97), PX4FMUv2.4.6_1 (U202.6)
NetU101_98: PX4FMUv2.4.6_0 (U101.98), PX4FMUv2.4.6_1 (U202.7)
NetU801_10: PX4FMUv2.4.6_7 (U801.10), PX4FMUv2.4.6_8 (U902.9)
NetU801_11: PX4FMUv2.4.6_7 (U801.11), PX4FMUv2.4.6_8 (U902.8)
NetU801_16: PX4FMUv2.4.6_7 (U801.16), PX4FMUv2.4.6_8 (U902.5)
NetU801_17: PX4FMUv2.4.6_7 (U801.17), PX4FMUv2.4.6_8 (U902.4)
NetU801_18: PX4FMUv2.4.6_7 (U801.18), PX4FMUv2.4.6_8 (U902.3)
NetU801_19: PX4FMUv2.4.6_7 (U801.19), PX4FMUv2.4.6_8 (U902.1)
NetU801_21: PX4FMUv2.4.6_7 (U801.21), PX4FMUv2.4.6_8 (U903.5)
NetU801_22: PX4FMUv2.4.6_7 (U801.22), PX4FMUv2.4.6_8 (U903.6)
NetU801_38: PX4FMUv2.4.6_7 (U801.38), PX4FMUv2.4.6_9 (U1001.4)
NetU801_40: PX4FMUv2.4.6_7 (U801.40), PX4FMUv2.4.6_8 (U903.7)
NetU801_45: PX4FMUv2.4.6_7 (U801.45), PX4FMUv2.4.6_8 (U902.7)
NetU801_46: PX4FMUv2.4.6_7 (U801.46), PX4FMUv2.4.6_8 (U902.6)